# Altium schematic sheet NRF24L01P.SchDoc
size A; SheetNumber: 4; SheetTotal: 9
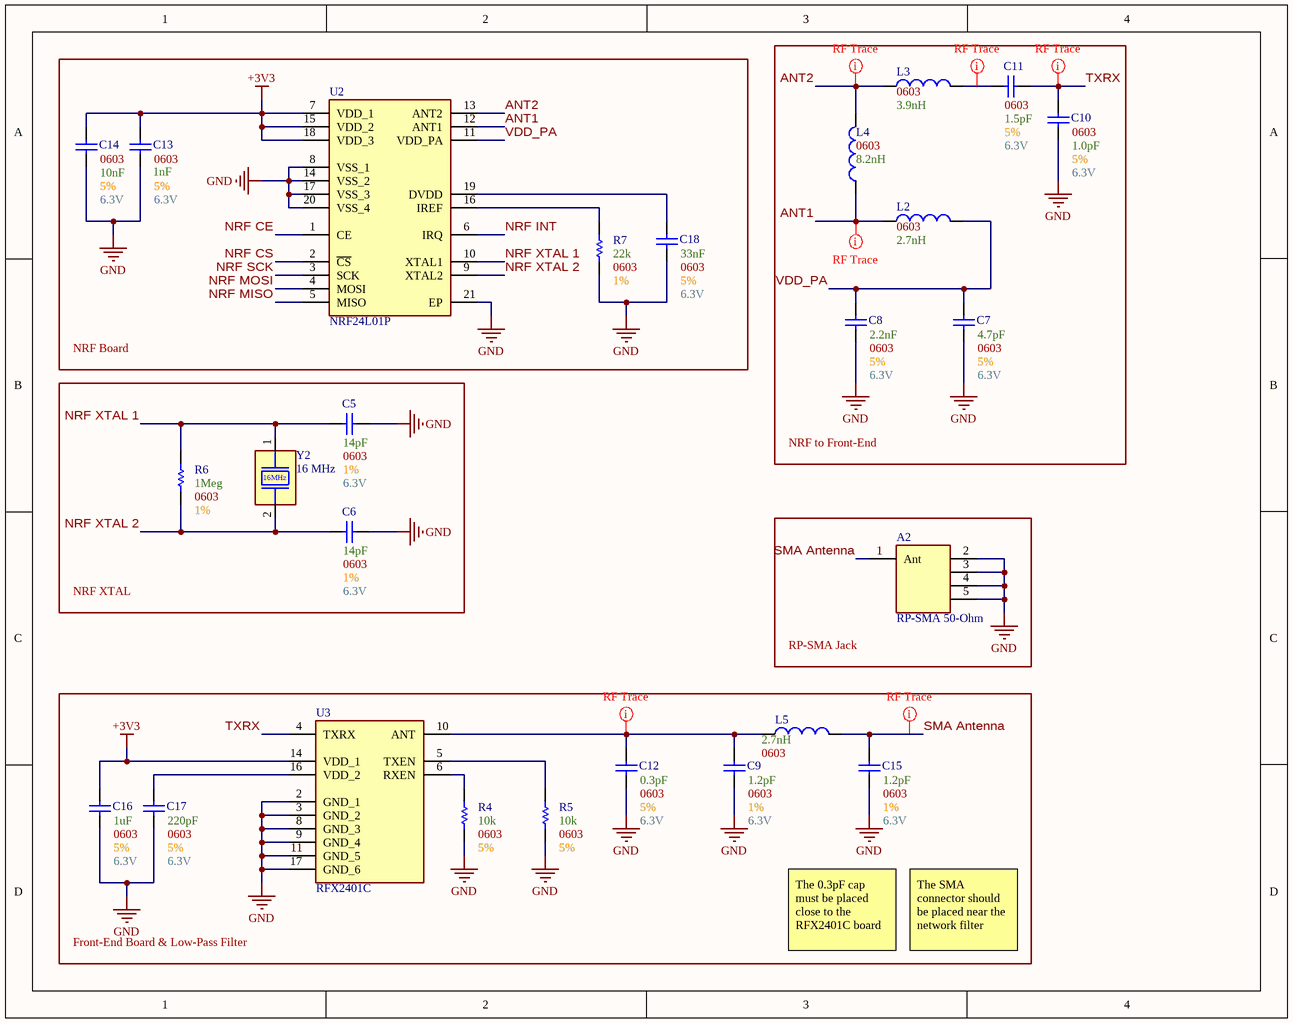
[diagram p0: NRF24L01P.SchDoc]

## Parts
A2  RP-SMA 50-Ohm  [[SMA] RP-SMA 90deg Jack]
C5  Tolerance: 1%  Size Package: 0603  Capacitance: 14pF  Voltage: 6.3V  [[Cap] SMD 0603]  (hidden comment: SMD Nonpolarized)
C6  Tolerance: 1%  Size Package: 0603  Capacitance: 14pF  Voltage: 6.3V  [[Cap] SMD 0603]  (hidden comment: SMD Nonpolarized)
C7  Tolerance: 5%  Size Package: 0603  Capacitance: 4.7pF  Voltage: 6.3V  [[Cap] SMD 0603]  (hidden comment: SMD Nonpolarized)
C8  Tolerance: 5%  Size Package: 0603  Capacitance: 2.2nF  Voltage: 6.3V  [[Cap] SMD 0603]  (hidden comment: SMD Nonpolarized)
C9  Voltage: 6.3V  Tolerance: 1%  Size Package: 0603  Capacitance: 1.2pF  [[Cap] SMD 0603]  (hidden comment: SMD Nonpolarized)
C10  Tolerance: 5%  Size Package: 0603  Capacitance: 1.0pF  Voltage: 6.3V  [[Cap] SMD 0603]  (hidden comment: SMD Nonpolarized)
C11  Tolerance: 5%  Size Package: 0603  Capacitance: 1.5pF  Voltage: 6.3V  [[Cap] SMD 0603]  (hidden comment: SMD Nonpolarized)
C12  Tolerance: 5%  Size Package: 0603  Capacitance: 0.3pF  Voltage: 6.3V  [[Cap] SMD 0603]  (hidden comment: SMD Nonpolarized)
C13  Tolerance: 5%  Size Package: 0603  Capacitance: 1nF  Voltage: 6.3V  [[Cap] SMD 0603]  (hidden comment: SMD Nonpolarized)
C14  Tolerance: 5%  Size Package: 0603  Capacitance: 10nF  Voltage: 6.3V  [[Cap] SMD 0603]  (hidden comment: SMD Nonpolarized)
C15  Voltage: 6.3V  Tolerance: 1%  Size Package: 0603  Capacitance: 1.2pF  [[Cap] SMD 0603]  (hidden comment: SMD Nonpolarized)
C16  Tolerance: 5%  Size Package: 0603  Capacitance: 1uF  Voltage: 6.3V  [[Cap] SMD 0603]  (hidden comment: SMD Nonpolarized)
C17  Tolerance: 5%  Size Package: 0603  Capacitance: 220pF  Voltage: 6.3V  [[Cap] SMD 0603]  (hidden comment: SMD Nonpolarized)
C18  Tolerance: 5%  Size Package: 0603  Capacitance: 33nF  Voltage: 6.3V  [[Cap] SMD 0603]  (hidden comment: SMD Nonpolarized)
L2  Size Package: 0603  Inductance: 2.7nH  [[Inductor] SMD 0603]  (hidden comment: SMD Inductor)
L3  Size Package: 0603  Inductance: 3.9nH  [[Inductor] SMD 0603]  (hidden comment: SMD Inductor)
L4  Size Package: 0603  Inductance: 8.2nH  [[Inductor] SMD 0603]  (hidden comment: SMD Inductor)
L5  Size Package: 0603  Inductance: 2.7nH  [[Inductor] SMD 0603]  (hidden comment: SMD Inductor)
R4  Tolerance: 5%  Resistance: 10k  Size Package: 0603  [[Res] SMD 0603]  (hidden comment: [Res] SMD Resistor)
R5  Tolerance: 5%  Resistance: 10k  Size Package: 0603  [[Res] SMD 0603]  (hidden comment: [Res] SMD Resistor)
R6  Tolerance: 1%  Resistance: 1Meg  Size Package: 0603  [[Res] SMD 0603]  (hidden comment: [Res] SMD Resistor)
R7  Tolerance: 1%  Resistance: 22k  Size Package: 0603  [[Res] SMD 0603]  (hidden comment: [Res] SMD Resistor)
U2  NRF24L01P  [[IC] NRF Transceiver]
U3  RFX2401C  [[IC] RF Front-End]
Y2  16 MHz  [[XTAL] SMD 16MHz (2)]

## Blocks framed on the sheet
NRF Board: C13 C14 C18 R7 U2
NRF to Front-End: C7 C8 C10 C11 L2-L4
NRF XTAL: C5 C6 R6 Y2
RP-SMA Jack: A2
Front-End Board & Low-Pass Filter: C9 C12 C15-C17 L5 R4 R5 U3

## Nets
+3V3: C13.2 C14.2 C16.2 U2.7(VDD_1) U2.15(VDD_2) U2.18(VDD_3) U3.14(VDD_1)
GND: A2.2 A2.3 A2.4 A2.5 C5.2 C6.2 C7.1 C8.1 C9.1 C10.2 C12.1 C13.1 C14.1 C15.1 C16.1 C17.1 C18.1 R4.1 R5.1 R7.1 U2.8(VSS_1) U2.14(VSS_2) U2.17(VSS_3) U2.20(VSS_4) U2.21(EP) U3.2(GND_1) U3.3(GND_2) U3.8(GND_3) U3.9(GND_4) U3.11(GND_5) U3.17(GND_6)
ANT1: L2.1 L4.1 U2.12(ANT1)
ANT2: L3.1 L4.2 U2.13(ANT2)
NRF CE: U2.1(CE)
NRF CS: U2.2(~{CS})
NRF INT: U2.6(IRQ)
NRF MISO: U2.5(MISO)
NRF MOSI: U2.4(MOSI)
NRF SCK: U2.3(SCK)
NRF XTAL 1: C5.1 R6.1 U2.10(XTAL1) Y2.1(XTAL1)
NRF XTAL 2: C6.1 R6.2 U2.9(XTAL2) Y2.2(XTAL2)
SMA Antenna: A2.1(Ant) C15.2 L5.2
TXRX: C10.1 C11.1 U3.4(TXRX)
VDD_PA: C7.2 C8.2 L2.2 U2.11(VDD_PA)
NetC9_2: C9.2 C12.2 L5.1 U3.10(ANT)
NetC11_2: C11.2 L3.2
NetC17_2: C17.2 U3.16(VDD_2)
NetC18_2: C18.2 U2.19(DVDD)
NetR4_2: R4.2 U3.6(RXEN)
NetR5_2: R5.2 U3.5(TXEN)
NetR7_2: R7.2 U2.16(IREF)

## Layout directives
net class nRF Signal: ANT1, ANT2, NetC9_2, NetC11_2, SMA Antenna, TXRX

## Notes on the sheet
- The 0.3pF cap must be placed close to the RFX2401C board
- The SMA connector should be placed near the network filter
- (in symbol [XTAL] SMD 16MHz (2)) 16MHz

## Library data of the parts
A2 = [SMA] RP-SMA 90deg Jack: PCB.RPSMAFRA.HT; Supplier 1: DigiKey; Supplier Part Number 1: 931-1360-ND
C5-C18 = [Cap] SMD Nonpolarized: Supplier 1: DigiKey
  C5 C6: Supplier Part Number 1: 311-3887-1-ND
  C7: Supplier Part Number 1: 13-CC0603CPNPO9BN4R7CT-ND
  C8: Supplier Part Number 1: 490-1459-1-ND
  C9 C15: Supplier Part Number 1: 4713-CHV0603N2501R2BCT-ND
  C10: Supplier Part Number 1: 311-1049-1-ND
  C11: Supplier Part Number 1: 311-1737-1-ND
  C12: Supplier Part Number 1: 712-QSCP251Q0R3A1GV001TCT-ND
  C13: Supplier Part Number 1: 490-1451-6-ND
  C14: Supplier Part Number 1: 399-C0603C103J5RACTUDKR-ND
  C16: Supplier Part Number 1: 311-3485-1-ND
  C17: Supplier Part Number 1: 399-C0603C221J5GAC7411CT-ND
  C18: Supplier Part Number 1: 311-4015-1-ND
L2-L5 = [Inductor] SMD Inductor: JLC Part #: *; Mouser Part #: *; Supplier 1: DigiKey
  L2: Supplier Part Number 1: 490-1103-1-ND
  L3: Supplier Part Number 1: 490-1105-1-ND
  L4: Supplier Part Number 1: 490-1109-1-ND
  L5: Supplier Part Number 1: 732-7447860027GCT-ND
R4-R7 = [Res] SMD Resistor: Generic; Supplier 1: DigiKey
  R4 R5: Supplier Part Number 1: 311-10.0KHRDKR-ND
  R6: Supplier Part Number 1: YAG4498CT-ND
  R7: Supplier Part Number 1: 311-22.0HRDKR-ND
U2 = [IC] NRF Transceiver: NRF24L01P-R; Supplier 1: DigiKey; Supplier Part Number 1: 4823-NRF24L01P-RCT-ND
U3 = [IC] RF Front-End: Supplier 1: DigiKey; Supplier Part Number 1: 863-1828-1-ND
Y2 = [XTAL] SMD 16MHz (2): ABM11-16.000MHZ-12-N1G-T; Supplier 1: DigiKey; Supplier Part Number 1: 535-14950-1-ND